# Altium schematic sheet [02] - BLOCK DIAGRAM.SchDoc
size A3; CompanyName: FPT-FTI copporation; Address1: FPT Building Duy Tan; Address2: Floor 4,; DocumentNumber: 2; SheetNumber: 2; SheetTotal: 5; NameAuthor: Angle Vu

## Notes on the sheet
- Designed By
- Page Name:
- Checked By
- Size:
- A3
- Company:
- Address:
- Sheet:
- /